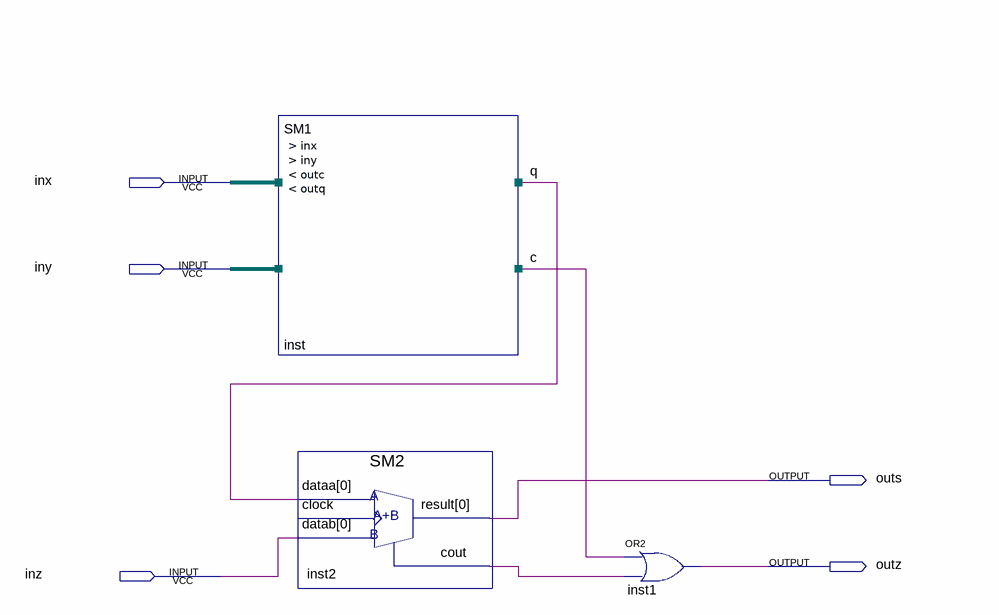
[diagram p0: schematic sheet]
// Quartus schematic Lab1_SM.bdf as structural Verilog: 3 symbols, 5 pins
module Lab1_SM (
  input  inx,
  input  iny,
  input  inz,
  output outs,
  output outz
);

  wire c, inst2_cout, q;

  SM1 inst (.inx(inx), .iny(iny), .outc(c), .outq(q));
  SM2 inst2 (.dataa(q), .datab(inz), .result(outs), .cout(inst2_cout));  // open: clock
  or inst1 (outz, c, inst2_cout);
endmodule
